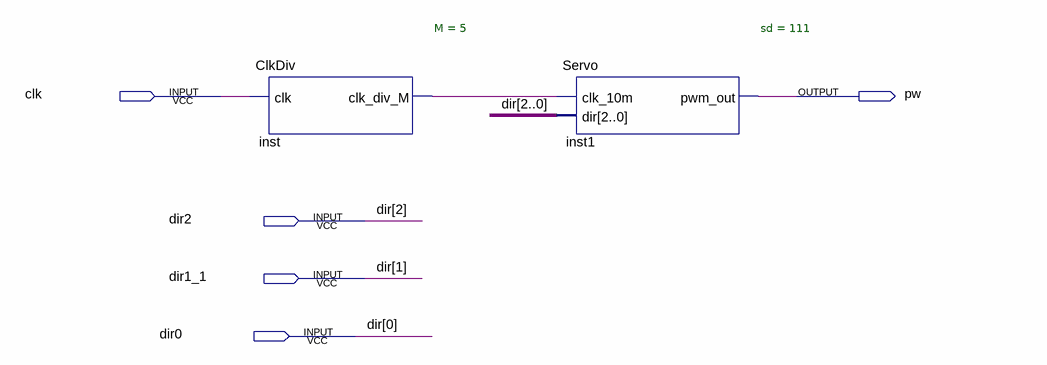
[diagram p0: schematic sheet]
// Quartus schematic ServoTest.bdf as structural Verilog: 2 symbols, 5 pins
module ServoTest (
  input  clk,
  input  dir2,
  input  dir1_1,
  input  dir0,
  output pw
);

  wire inst_clk_div_m;

  ClkDiv #(.M(5)) inst (.clk(clk), .clk_div_M(inst_clk_div_m));
  Servo #(.sd(111)) inst1 (.clk_10m(inst_clk_div_m), .dir({dir2, dir1_1, dir0}), .pwm_out(pw));

  // Other names for the same wires on the sheet: dir[1] = dir1_1
endmodule
